# EAGLE design FD Capacitance Sensor v13 (EAGLE 9.5.2)
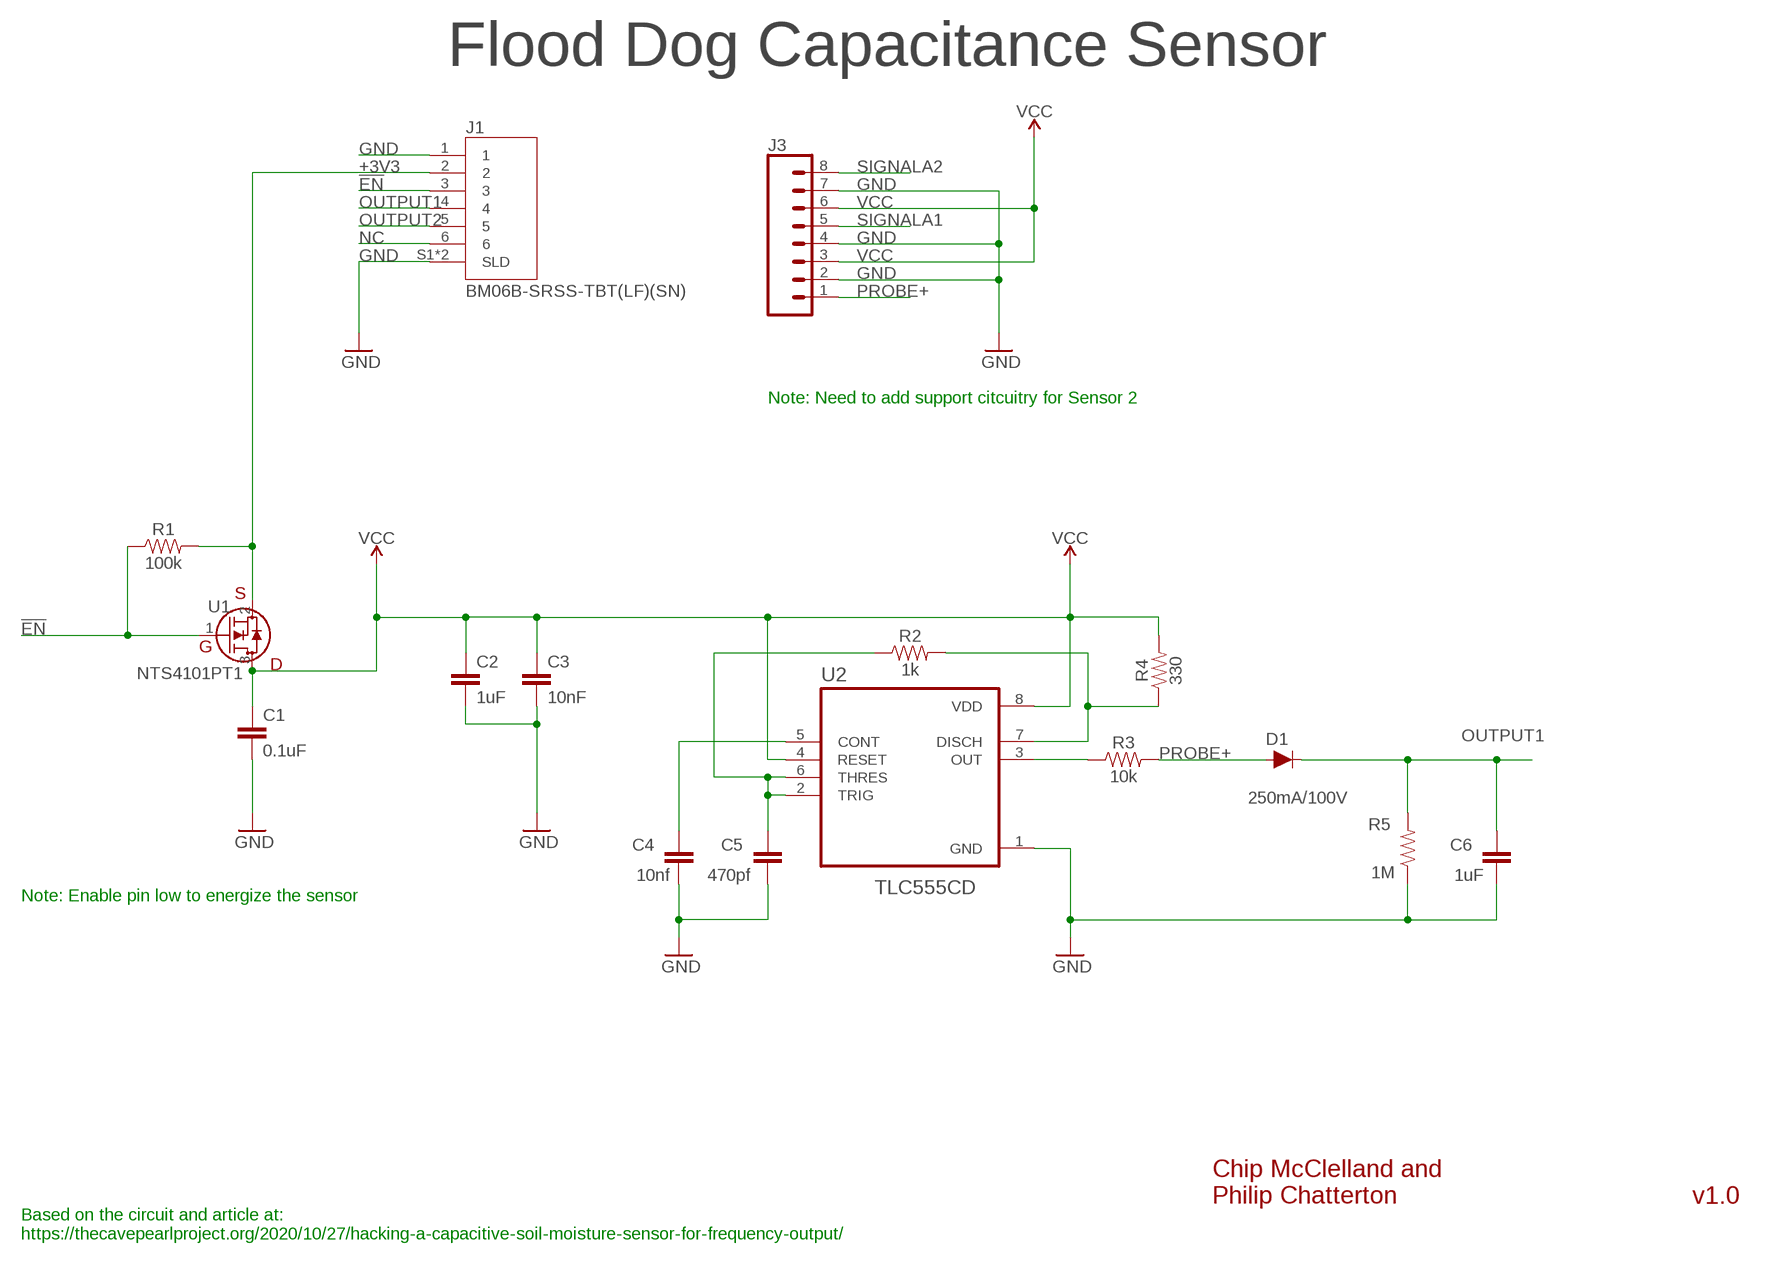
[diagram p0: schematic, sheet 1]

## Parts
C1  0.1uF  CAP-MF-0.1UF-0805  [0805@1]
C2  1uF  CAP-MF-1UF-0805  [0805@1]
C3  10nF  CAP-10NF-0805  [0805@1]
C4  10nf  C-EUC0805  [C0805]
C5  470pf  C-EUC0805  [C0805]
C6  1uF  C-EUC0805  [C0805]
D1  250mA/100V  DIODE-BAS16J  [SOD-323]
J1  BM06B-SRSS-TBT(LF)(SN)  [JST_BM06B-SRSS-TB(LF)(SN)]
J3  CONN_08"  [1X08]
R1  100k  RESISTOR-MF-100K-0805  [0805]
R2  1k  RESISTOR-MF-1K-0805  [0805]
R3  10k  RESISTOR-MF-10K-0805  [0805]
R4  330  RESISTOR-MF-330-0805  [0805]
R5  1M  RESISTOR-MF-1K-0805  [0805]
U1  NTS4101PT1  [SOT_101PT1_ONS]
U2  TLC555CD  [SOIC127P599X175-8N]

## Nets
!EN: J1.3 R1.1 U1.1(G)
+3V3: J1.2 R1.2 U1.2(S)
GND: C1.2 C2.2 C3.2 C4.1 C5.1 C6.1 J1.1 J1.S1(SLD) J1.S2(SLD) J3.2 J3.4 J3.7 R5.1 U2.1(GND)
N$1: C4.2 U2.5(CONT)
N$5: R3.1 U2.3(OUT)
N$8: C5.2 R2.1 U2.2(TRIG) U2.6(THRES)
N$9: R2.2 R4.1 U2.7(DISCH)
NC: J1.6
OUTPUT1: C6.2 D1.C J1.4 R5.2
OUTPUT2: J1.5
PROBE+: D1.A J3.1 R3.2
SIGNALA1: J3.5
SIGNALA2: J3.8
VCC [VCC]: C1.1 C2.1 C3.1 J3.3 J3.6 R4.2 U1.3(D) U2.4(RESET) U2.8(VDD)

## Notes on the sheet
- Flood Dog Capacitance Sensor
- Note: Need to add support citcuitry for Sensor 2
- Note: Enable pin low to energize the sensor
- Chip McClelland and
  Philip Chatterton
- v1.0
- Based on the circuit and article at:
  https://thecavepearlproject.org/2020/10/27/hacking-a-capacitive-soil-moisture-sensor-for-frequency-output/

## Library data of the parts
C1 = Custom Components:CAP-MF-0.1UF-: Capacitor Macrofab House Part (https://factory.macrofab.com/parts). Standard ceramic capacitor, and 0.1" leaded capacitor.; HOUSEPART: YES; MPN: MF-CAP-0805-0.1uF; POPULATE: 1; URL: https://factory.macrofab.com/part/MF-CAP-0805-0.1uF
C2 = Custom Components:CAP-MF-1UF-: Capacitor Macrofab House Part (https://factory.macrofab.com/parts). Standard ceramic capacitor, and 0.1" leaded capacitor.; HOUSEPART: yes; MPN: MF-CAP-0805-1uF; POPULATE: 1; URL: https://factory.macrofab.com/part/MF-CAP-0805-1uF
C3 = Custom Components:CAP-10NF-: Capacitor 10nF variant Standard 0805 ceramic capacitor; DIGIKEY: 399-C0805X103K1RAC3316CT-ND; HOUSEPART: NO; MPN: C0805X103K1RAC3316; POPULATE: 1; URL: https://www.digikey.com/en/products/detail/kemet/C0805X103K1RAC3316/10315780
C4-C6 = rcl:C-EU: CAPACITOR, European symbol; SPICEPREFIX: C
D1 = Custom Components:DIODE: Diode These are standard reverse protection diodes and small signal diodes. SparkFun Products: SparkFun SparkPunk Sound Kit <https://www.sparkfun.com/products/11177> SparkFun ESP8266 Thing <https://www.sparkfun.com/products/13231>; MPN: BAS16HT1G
J1 = Custom Components:BM06B-SRSS-TBT(LF)(SN): 6 Position 1.0mm Top-Entry Surface Mount Shrouded Header; MPN: BM06B-SRSS-TBT(LF)(SN); POPULATE: 1
J3 = SparkFun-Connectors:CONN_08: Multi connection point. Often used as Generic Header-pin footprint for 0.1 inch spaced/style header connections On any of the 0.1 inch spaced packages, you can populate with these: Break Away Headers - Straight <https://www.sparkfun.com/products/116> (PRT-00116) Break Away Male Headers - Right Angle <https://www.sparkfun.com/products/553> (PRT-00553) Female Headers <https://www.sparkfun.com/products/115> (PRT-00115) Break Away Headers - Machine Pin <https://www.sparkfun.com/products/117> (PRT-00117) Break Away Female Headers - Swiss Machine Pin <https://www.sparkfun.com/products/743> (PRT-00743) Arduino Stackable Header - 8 Pin <https://www.sparkfun.com/products/9279> (PRT-09279) For SCREWTERMINALS and SPRING TERMINALS visit here: Screw Terimnals on SparkFun.com <https://www.sparkfun.com/search/results?term=Screw+Terminals> (5mm/3.5mm/2.54mm spacing) This device is also useful as a general connection point to wire up your design to another part of your project. Our various solder wires solder well into these plated through hole pads. Hook-Up Wire - Assortment (Stranded, 22 AWG) <https://www.sparkfun.com/products/11375> (PRT-11375) Hook-Up Wire - Assortment (Solid Core, 22 AWG) <https://www.sparkfun.com/products/11367> (PRT-11367) View the entire wire category on our website here <https://www.sparkfun.com/categories/141> Special notes: Molex polarized connector foot print use with SKU : PRT-08231 with associated crimp pins and housings. 1MM SMD Version SKU: PRT-10208 NOTES ON THE VARIANTS LOCK and LOCK_LONGPADS... This footprint was designed to help hold the alignment of a through-hole component (i.e. 6-pin header) while soldering it into place. You may notice that each hole has been shifted either up or down by 0.005 of an inch from it's more standard position (which is a perfectly straight line). This slight alteration caused the pins (the squares in the middle) to touch the edges of the holes. Because they are alternating, it causes a "brace" to hold the component in place. 0.005 has proven to be the perfect amount of "off-center" position when using our standard breakaway headers. Although looks a little odd when you look at the bare footprint, once you have a header in there, the alteration is very hard to notice. Also,if you push a header all the way into place, it is covered up entirely on the bottom side.; PROD_ID: CONN-08438
R1 = Custom Components:RESISTOR-MF-100K-: Generic 0805 Resistor Package; MPN: MF-RES-0805-100K; POPULATE: 1; URL: https://factory.macrofab.com/part/MF-RES-0805-100K
R2 = Custom Components:RESISTOR-MF-1K-: Generic 0805 Resistor Package; HOUSEPART: YES; MPN: MF-RES-0805-1K; POPULATE: 1; URL: https://factory.macrofab.com/part/MF-RES-0805-1k
R3 = Custom Components:RESISTOR-MF-10K-: Generic 0805 Resistor Package; MPN: MF-RES-0805-10K; POPULATE: 1; URL: https://factory.macrofab.com/part/MF-RES-0805-10K
R4 = Custom Components:RESISTOR-MF-330-: Generic 0805 Resistor Package; HOUSEPART: YES; MPN: MF-RES-0805-330; POPULATE: 1
R5 = Custom Components:RESISTOR-MF-1K-: Generic 0805 Resistor Package; HOUSEPART: YES; MPN: MF-RES-0805-1K; POPULATE: 1; URL: https://factory.macrofab.com/part/MF-RES-0805-1k; VALUE: 1k
U1 = Custom Components:NTS4101PT1; DATASHEET: https://datasheet.octopart.com/NTS4101PT1-ON-Semiconductor-datasheet-139013286.pdf; MANUFACTURER_PART_NUMBER: NTS4101PT1; SOURCELIBRARY: ON_Semiconductor_2020-03-06; VENDOR: ON Semiconductor
U2 = Custom Components:TLC555CD; DESCRIPTION: 2.1-MHz, 250-A, Low-Power Timer 8-SOIC 0 to 70; DIGI-KEY_PART_NUMBER: 296-52992-ND; MF: Texas Instruments; MP: TLC555CD; PACKAGE: SOIC-8 Texas Instruments; PURCHASE-URL: https://pricing.snapeda.com/search/part/TLC555CD/?ref=eda

## Board
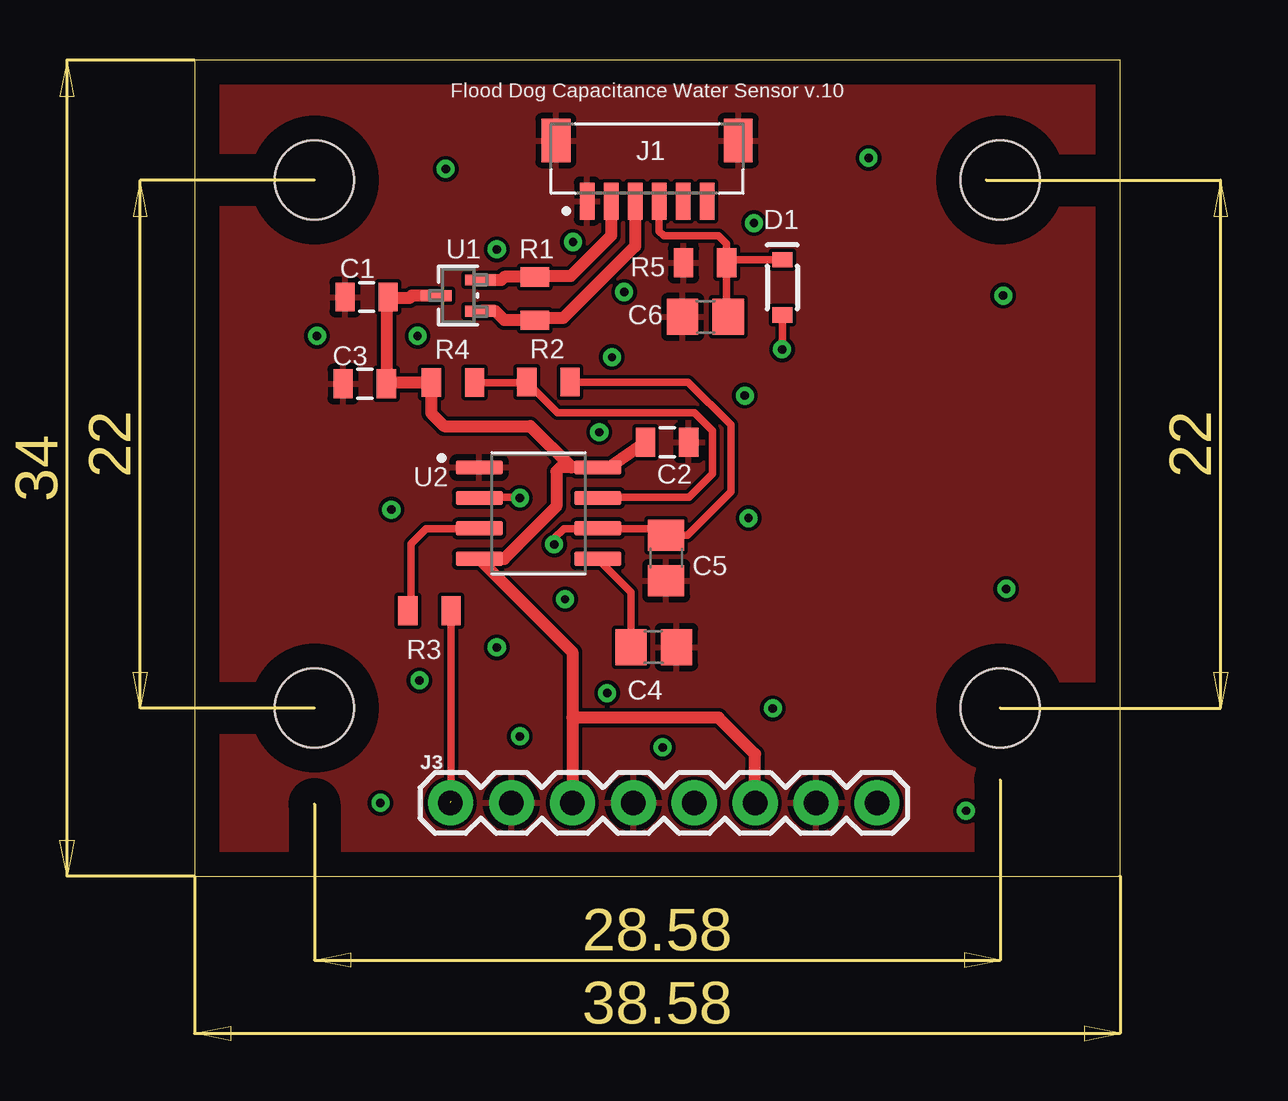
[diagram p1: board, top side]
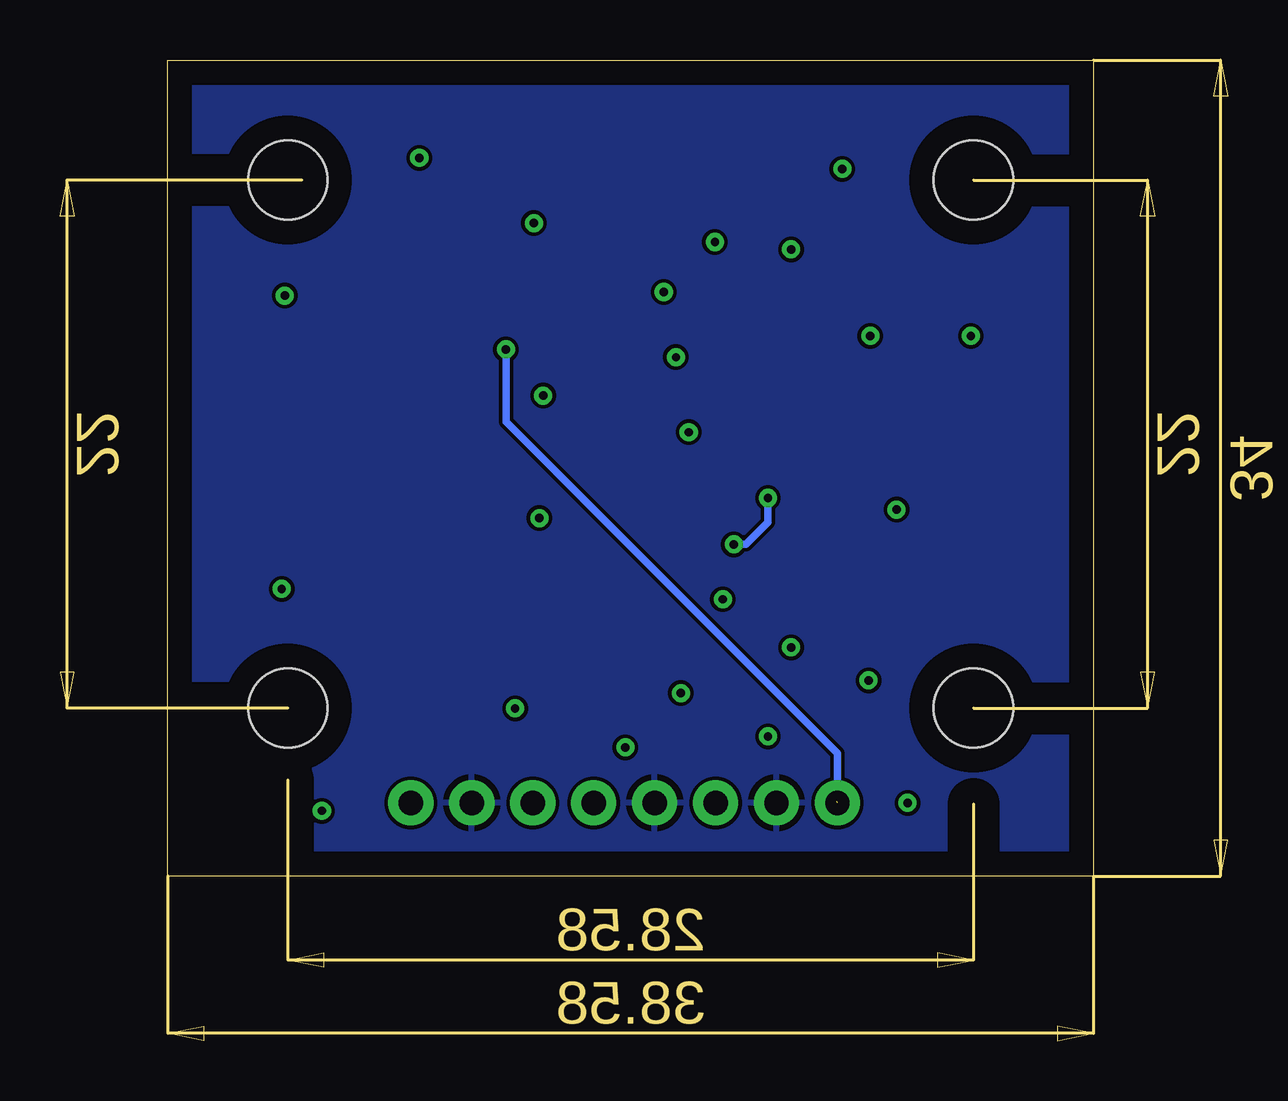
[diagram p2: board, bottom side, seen from below]

Size 38.58 x 34 mm. Coordinates in mm from the lower left corner, seen from the top.
Outline: 0,0 38.58,0 38.58,34 0,34 0,0
Copper layers (1*16): Top 0.035mm / dielectric 1.5mm / Bottom 0.035mm
Design rules "default": minimum track width 6mil, minimum drill 0.35mm, track to track 6mil, track to pad 6mil, pad to pad 6mil, via to via 6mil, smd to smd 6mil, copper to edge 40mil, drill to drill 6mil, minimum pad ring 10mil, minimum via ring 8mil, stop-mask expansion 4mil, vias tented up to drill 0mil, thermal gap 10mil

### Footprints (pad centres in the part's own frame; a part is rotated, then mirrored left to right if it is on the bottom)
0805@1 = smd 0.8 x 1.2: 1 -0.9,0; 2 0.9,0
C0805 = smd 1.3 x 1.5: 1 -0.95,0; 2 0.95,0
SOD-323 = smd 0.63 x 0.83: A 1.15,0; C -1.15,0
JST_BM06B-SRSS-TB(LF)(SN) = smd 0.6 x 1.55: 1 -2.5,-2.525; 2 -1.5,-2.525; 3 -0.5,-2.525; 4 0.5,-2.525; 5 1.5,-2.525; 6 2.5,-2.525 | smd 1.2 x 1.8: S1 -3.8,0; S2 3.8,0
1X08 = drill 1.016 pad 1.88: 1 0,0; 2 2.54,0; 3 5.08,0; 4 7.62,0; 5 10.16,0; 6 12.7,0; 7 15.24,0; 8 17.78,0
0805 = smd 0.8 x 1.2: 1 -0.9,0; 2 0.9,0
SOT_101PT1_ONS = smd 0.457 x 1.27: 1 -0.65,-0.914; 2 0.65,-0.914; 3 0,0.914
SOIC127P599X175-8N = smd 1.97 x 0.6: 1 -2.47,1.905; 2 -2.47,0.635; 3 -2.47,-0.635; 4 -2.47,-1.905; 5 2.47,-1.905; 6 2.47,-0.635; 7 2.47,0.635; 8 2.47,1.905
STAND-OFF = hole 3.302: 0,0

### Placement (x,y rotation side)
C1  7.17,24.12 180 top
C2  19.69,18.07 0 top
C3  7.1,20.5 180 top
C4  19.14,9.54 180 top
C5  19.66,13.25 90 top
C6  21.29,23.3 0 top
D1  24.5,24.53 270 top
J1  18.86,30.65 0 top
J3  10.67,3.05 0 top
R1  14.18,24.06 90 top
R2  14.75,20.58 180 top
R3  9.79,11.05 0 top
R4  10.77,20.56 180 top
R5  21.28,25.55 0 top
U1  10.99,24.18 90 top
U2  14.33,15.12 0 top
U$1  STAND-OFF  [STAND-OFF]  5,7 0 top
U$2  STAND-OFF  [STAND-OFF]  5,29 0 top
U$3  STAND-OFF  [STAND-OFF]  33.58,29 0 top
U$4  STAND-OFF  [STAND-OFF]  33.58,7 0 top

### Tracks (layer width: path | path; a pad name or v marks a point on that pad's centre or on a via)
!EN
  Top 0.152: R1.1 14.17,23.24 14.17,23.32 | 11.96,23.55 U1.1 | 18.29,28.12 J1.3
  Top 0.508: J1.3 18.36,26.23 15.37,23.24 14.17,23.24 | R1.1 12.91,23.16 12.53,23.55 11.96,23.55
+3V3
  Top 0.152: 14.17,24.92 R1.2 14.25,24.99 14.4,25.15 | 11.96,24.84 U1.2 | 17.3,28.12 J1.2
  Top 0.508: 14.25,24.99 15.68,24.99 17.36,26.68 J1.2 | R1.2 12.91,24.96 12.78,24.83 U1.2
GND
  pour Top: -0.81,-0.55 -0.81,34.76 39.52,34.76 39.52,-0.55
  pour Bottom: -0.58,-0.35 -0.58,34.5 39.19,34.5 39.19,-0.35
N$1
  Top 0.152: 16.76,13.26 U2.5
  Top 0.305: U2.5 18.19,11.83 C4.2
N$2  (via drill 0.35)
  other vias: 12.6,26.11
N$3  (via drill 0.35)
  other vias: 9.3,22.5
N$4  (via drill 0.35)
  other vias: 5.11,22.5
N$5
  Top 0.152: 8.94,11.1 R3.1 | 11.81,14.48 U2.3
  Top 0.305: U2.3 9.65,14.48 9.02,13.84 9.02,11.18 R3.1
N$6  (via drill 0.35)
  other vias: 17.4,21.62
N$7  (via drill 0.35)
  other vias: 22.94,20.02
N$8  (via drill 0.35)
  Top 0.152: 16.84,14.48 U2.6 16.76,14.48 | 19.42,14.48 C5.2 | v13.56,15.75 13.54,15.77 | 11.89,15.77 U2.2
  Top 0.305: 19.42,14.48 16.84,14.48 | 13.54,15.77 11.89,15.77 | v14.99,13.82 14.99,14.07 15.39,14.48 16.76,14.48 | C5.2 20.55,14.2 22.35,16 22.35,18.8 20.57,20.57 R2.1
  Bottom 0.305: v14.99,13.82 14.48,13.82 13.56,14.73 v13.56,15.75
N$9
  Top 0.152: 11.73,20.57 R4.1 | 13.79,20.57 R2.2 13.79,20.5 | 16.84,15.77 U2.7
  Top 0.305: 16.84,15.77 20.6,15.77 21.59,16.76 21.59,18.54 20.83,19.3 15.13,19.3 R2.2 13.83,20.56 R4.1
N$10  (via drill 0.35)
  other vias: 23.32,27.2
N$11  (via drill 0.35)
  other vias: 15.44,11.53
N$12  (via drill 0.35)
  other vias: 12.6,9.53
N$13  (via drill 0.35)
  other vias: 13.56,5.82
N$14  (via drill 0.35)
  other vias: 19.51,5.36
N$15  (via drill 0.35)
  other vias: 17.2,7.62
N$16  (via drill 0.35)
  other vias: 24.1,6.99
N$17  (via drill 0.35)
  other vias: 23.09,14.91
N$18  (via drill 0.35)
  other vias: 16.87,18.49
N$19  (via drill 0.35)
  other vias: 8.2,15.27
N$20  (via drill 0.35)
  other vias: 9.37,8.15
N$21  (via drill 0.35)
  other vias: 17.91,24.33
N$22  (via drill 0.35)
  other vias: 15.77,26.42
N$23  (via drill 0.35)
  other vias: 33.71,24.18
N$24  (via drill 0.35)
  other vias: 33.83,11.96
N$25  (via drill 0.35)
  other vias: 7.75,3.05
N$26  (via drill 0.35)
  other vias: 32.16,2.72
N$27  (via drill 0.35)
  other vias: 10.46,29.46
N$28  (via drill 0.35)
  other vias: 28.09,29.92
OUTPUT1
  Top 0.305: R5.2 22.31,25.68 D1.C | J1.4 19.36,26.87 19.56,26.67 21.84,26.67 22.18,26.34 R5.2 | R5.2 22.18,23.36 C6.2
  Top 0.508: 22.24,25.48 R5.2
PROBE+  (via drill 0.35)  (1 unrouted)
  Top 0.152: v24.5,21.96 v24.49,21.95 | 10.69,11.02 R3.2
  Top 0.305: R3.2 10.69,3.12 | D1.A v24.5,21.96
  Bottom 0.305: v24.49,21.95 24.49,18.92 10.67,5.11 J3.1
VCC
  Top 0.152: C3.1 8,20.57 | 9.83,20.5 R4.2 9.91,20.5 | 8.08,24.16 C1.1 8,24.08 | 10.06,24.16 U1.3 | 11.89,13.26 U2.4 | 16.76,17.07 U2.8
  Top 0.508: 15.75,6.6 15.75,9.33 U2.4 12.9,13.21 15.08,15.4 15.08,16.86 15.25,17.02 U2.8 | 15.75,6.6 J3.3 | U2.8 15.71,17.02 13.99,18.75 10.41,18.75 9.87,19.29 R4.2 8.02,20.56 8,20.57 | U2.8 17.3,17.02 C2.1 | U1.3 9.06,24.18 8.95,24.08 8,24.08 | C1.1 8,24.05 C3.1 | J3.6 23.37,5.08 21.84,6.6 15.75,6.6

### Text on the board
tNames: Flood Dog Capacitance Water Sensor v.10